# Altium schematic sheet Sheet2.SchDoc
size A3
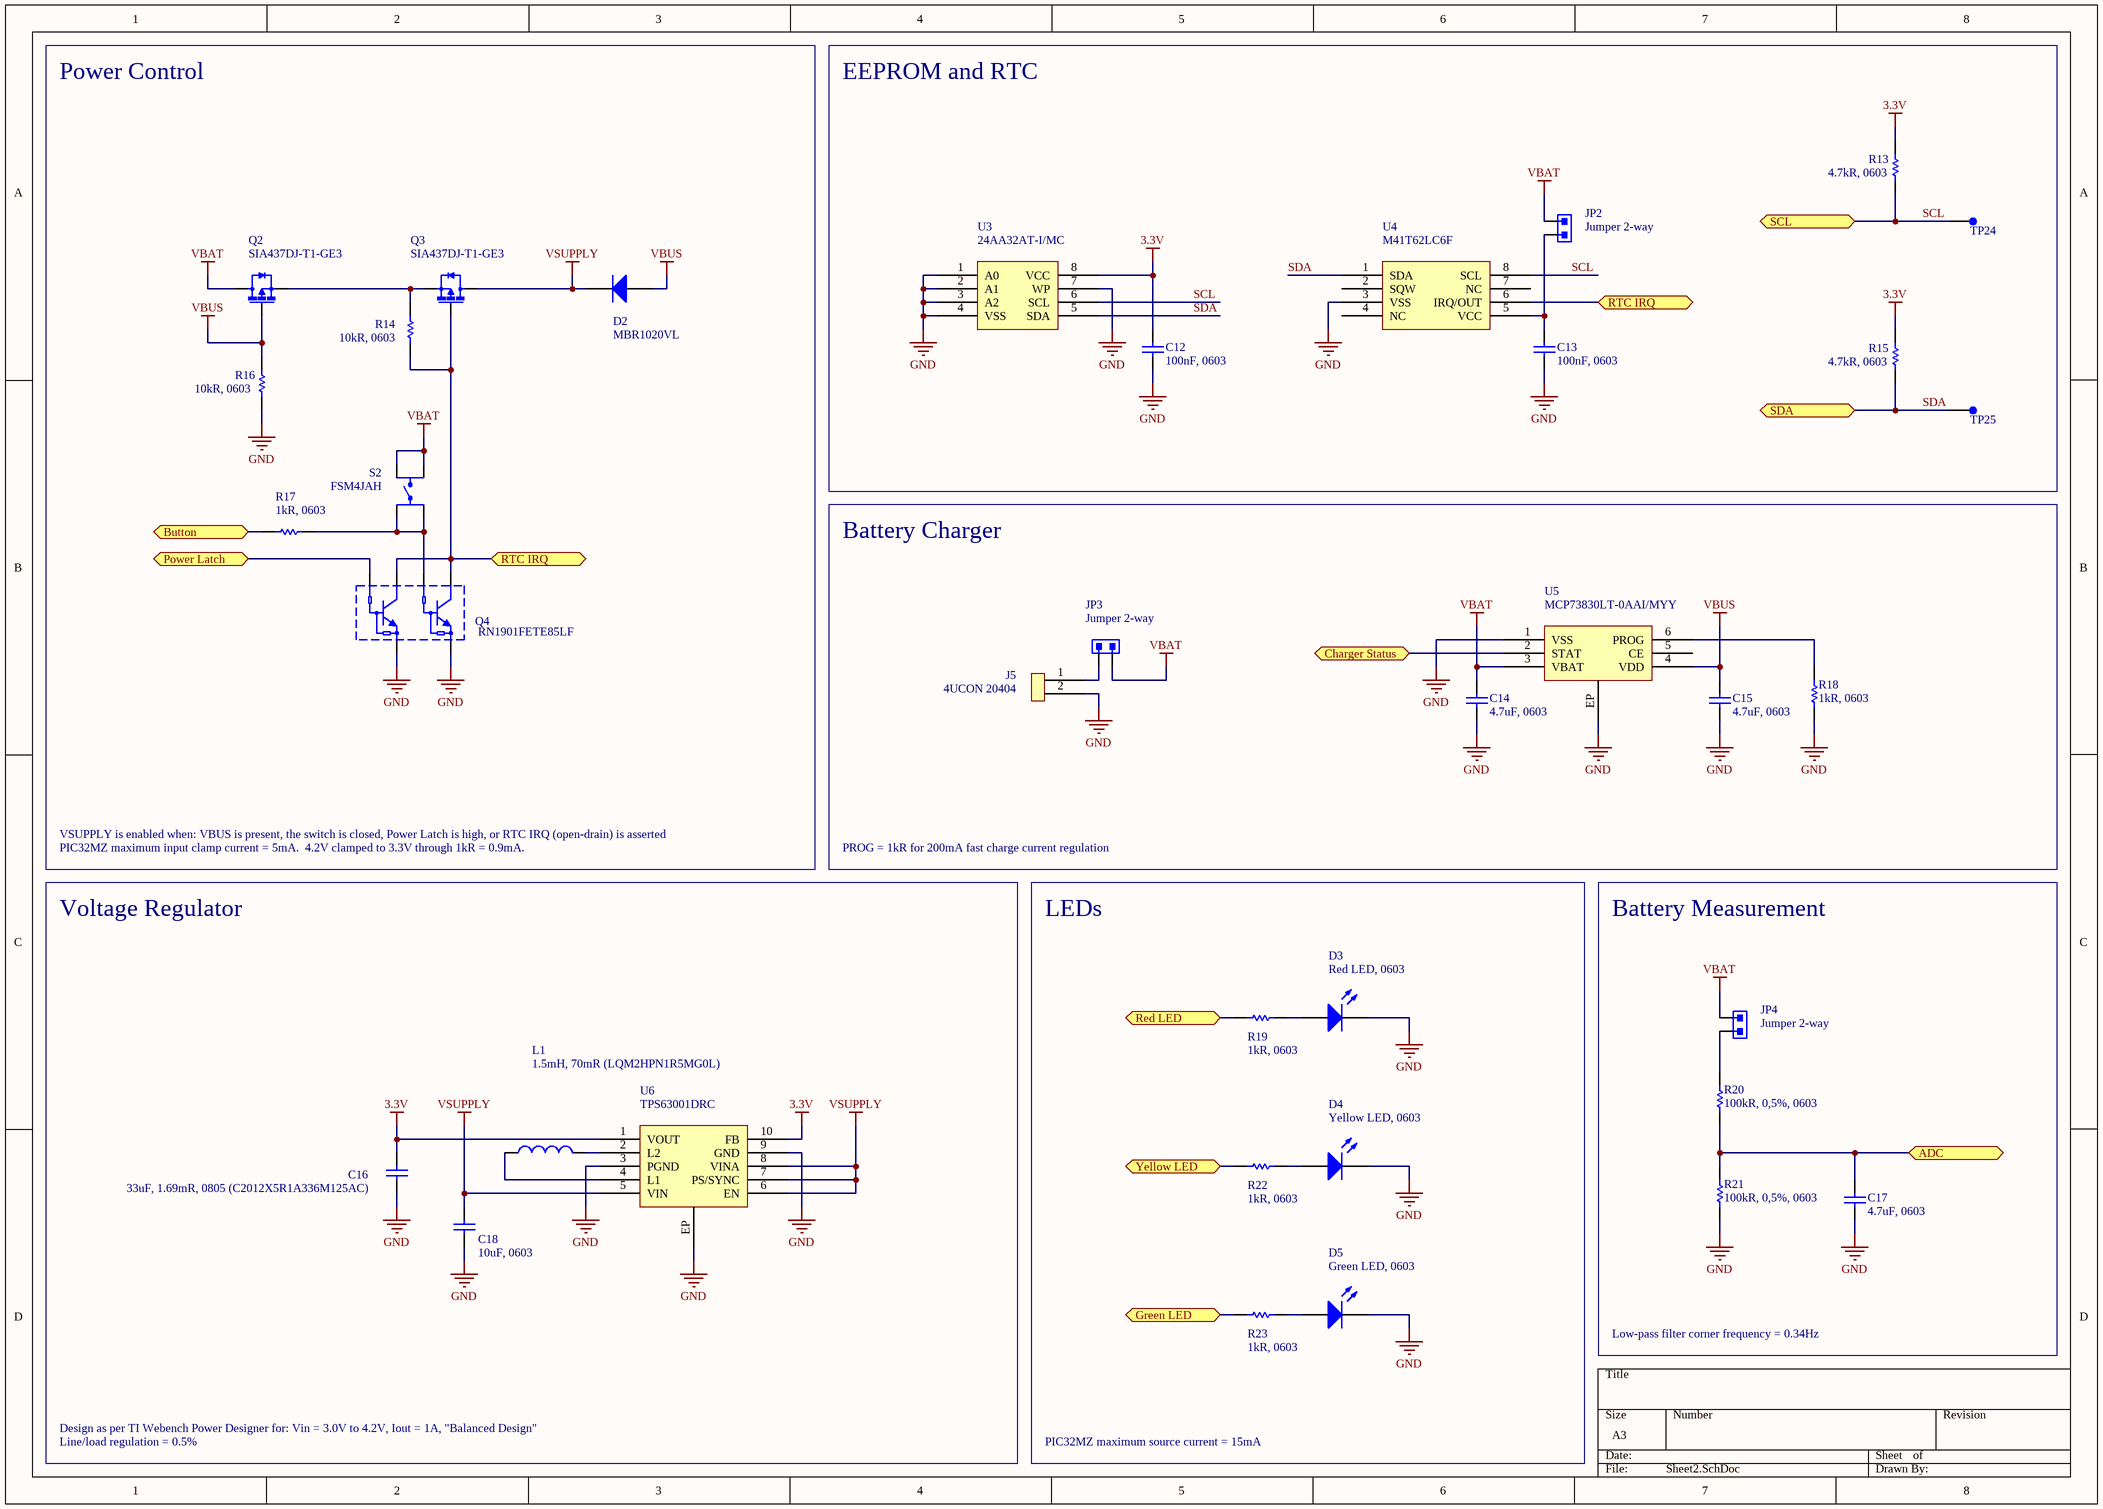
[diagram p0: Sheet2.SchDoc]

## Parts
C12  100nF, 0603  [Capacitor 0603]
C13  100nF, 0603  [Capacitor 0603]
C14  4.7uF, 0603  [Capacitor 0603]
C15  4.7uF, 0603  [Capacitor 0603]
C16  33uF, 1.69mR, 0805 (C2012X5R1A336M125AC)  [Capacitor 0805]
C17  4.7uF, 0603  [Capacitor 0603]
C18  10uF, 0603  [Capacitor 0603]
D2  MBR1020VL  [SOD-123]
D3  Red LED, 0603  [LED 0603]
D4  Yellow LED, 0603  [LED 0603]
D5  Green LED, 0603  [LED 0603]
J5  4UCON 20404  [4UCON 20404]
JP2  Jumper 2-way  [Jumper 2-way]
JP3  Jumper 2-way  [Jumper 2-way]
JP4  Jumper 2-way  [Jumper 2-way]
L1  1.5mH, 70mR (LQM2HPN1R5MG0L)  [Inductor 1008]
Q2  SIA437DJ-T1-GE3  [SIA437DJ-T1-GE3]
Q3  SIA437DJ-T1-GE3  [SIA437DJ-T1-GE3]
Q4  RN1901FETE85LF  [SOT-666]
R13  4.7kR, 0603  [Resistor 0603]
R14  10kR, 0603  [Resistor 0603]
R15  4.7kR, 0603  [Resistor 0603]
R16  10kR, 0603  [Resistor 0603]
R17  1kR, 0603  [Resistor 0603]
R18  1kR, 0603  [Resistor 0603]
R19  1kR, 0603  [Resistor 0603]
R20  100kR, 0,5%, 0603  [Resistor 0603]
R21  100kR, 0,5%, 0603  [Resistor 0603]
R22  1kR, 0603  [Resistor 0603]
R23  1kR, 0603  [Resistor 0603]
S2  FSM4JAH  [FSM4JHX]
TP24  Test Point  [Test Point 1.5mm]  (value not drawn)
TP25  Test Point  [Test Point 1.5mm]  (value not drawn)
U3  24AA32AT-I/MC  [TDFN-8 2x3mm]
U4  M41T62LC6F  [M41T62LC6F]
U5  MCP73830LT-0AAI/MYY  [TDFN-6 2x2mm]
U6  TPS63001DRC  [VSON-10]

## Blocks framed on the sheet
Power Control: D2 Q2-Q4 R14 R16 R17 S2
EEPROM and RTC: C12 C13 JP2 R13 R15 TP24 TP25 U3 U4
Battery Charger: C14 C15 J5 JP3 R18 U5
Voltage Regulator: C16 C18 L1 U6
LEDs: D3-D5 R19 R22 R23
Battery Measurement: C17 JP4 R20 R21

## Ports
ADC, Button, Charger Status, Green LED, Power Latch, Red LED, RTC IRQ, SCL, SDA, Yellow LED

## Nets
3.3V: C12.2 C16.1 R13.2 R15.2 U3.8(VCC) U6.1(VOUT) U6.10(FB)
GND: C12.1 C13.1 C14.1 C15.1 C16.2 C17.1 C18.1 D3.K D4.K D5.K J5.2 Q4.1(E1) Q4.4(E2) R16.1 R18.1 R21.1 U3.1(A0) U3.2(A1) U3.3(A2) U3.4(VSS) U3.7(WP) U4.3(VSS) U5.1(VSS) U5.EP U6.3(PGND) U6.9(GND) U6.EP
VBAT: C14.2 JP2.1 JP3.2 JP4.1 Q2.D S2.3 S2.4 U5.3(VBAT)
VBUS: C15.2 D2.A Q2.G R16.2 U5.4(VDD)
VSUPPLY: C18.2 D2.K Q3.D U6.5(VIN) U6.6(EN) U6.7(PS/SYNC) U6.8(VINA)
ADC: C17.2 R20.1 R21.2 ; port ADC
Button: R17.2 ; port Button
Charger Status: U5.2(STAT) ; port Charger Status
Green LED: R23.2 ; port Green LED
Power Latch: Q4.2(B1) ; port Power Latch
Red LED: R19.2 ; port Red LED
RTC IRQ: Q3.G Q4.3(C2) Q4.6(C1) R14.2 U4.6(IRQ/OUT) ; port RTC IRQ
SCL: R13.1 TP24.1 U3.6(SCL) U4.8(SCL) ; port SCL
SDA: R15.1 TP25.1 U3.5(SDA) U4.1(SDA) ; port SDA
Yellow LED: R22.2 ; port Yellow LED
NetC13_2: C13.2 JP2.2 U4.5(VCC)
NetD3_A: D3.A R19.1
NetD4_A: D4.A R22.1
NetD5_A: D5.A R23.1
NetJ5_1: J5.1 JP3.1
NetJP4_2: JP4.2 R20.2
NetL1_1: L1.1 U6.4(L1)
NetL1_2: L1.2 U6.2(L2)
NetQ2_S: Q2.S Q3.S R14.1
NetQ4_5: Q4.5(B2) R17.1 S2.1 S2.2
NetR18_2: R18.2 U5.6(PROG)

Not connected (* = marked no-connect by the designer): U4 2(SQW) 4(NC) 7(NC); U5 5(CE)

## Notes on the sheet
- VSUPPLY is enabled when: VBUS is present, the switch is closed, Power Latch is high, or RTC IRQ (open-drain) is asserted
- PIC32MZ maximum input clamp current = 5mA.  4.2V clamped to 3.3V through 1kR = 0.9mA.
- PROG = 1kR for 200mA fast charge current regulation
- Low-pass filter corner frequency = 0.34Hz
- Design as per TI Webench Power Designer for: Vin = 3.0V to 4.2V, Iout = 1A, "Balanced Design"
- Line/load regulation = 0.5%
- PIC32MZ maximum source current = 15mA

## Library data of the parts
C12-C18 = Capacitor
D2 = Diode
D3-D5 = LED
L1 = Inductor
Q2 Q3 = MOSFET P-Channel
R13-R23 = Resistor
S2 = Tactile Switch